# Altium project RFSOC_SAWG.PrjPCB (part 9 of 10)

## Sheet RF_PLL_channel.SchDoc: RFSOC SAWG
size 420 x 297 mm; Author: G.Kasprowicz; CompanyName: WUT; DrawnBy: G.Kasprowicz; Organization: WUT ISE; Address1: Warsaw Univeristy of Technology; Address2: Nowowiejska 15/19; DocumentNumber: 18; Revision: 1; SheetNumber: 18; SheetTotal: 20; EDA_Number: ARTIQ; Projet: ARTIQ/SINARA; ModifiedBy: -; CreateDate: XX/XX/XXXX; CheckedDate: -; Title2: RF PLL; DivGrp: ISE; Designer: G.Kasprowicz; ModifiedDate: -; ProjectName: ARTIQ/SINARA
Used 3 times, as channels U_RF_PLL_channel2, U_RF_PLL_channel0, U_RF_PLL_channel1. Parts and nets are listed once, with the designators drawn on the sheet.
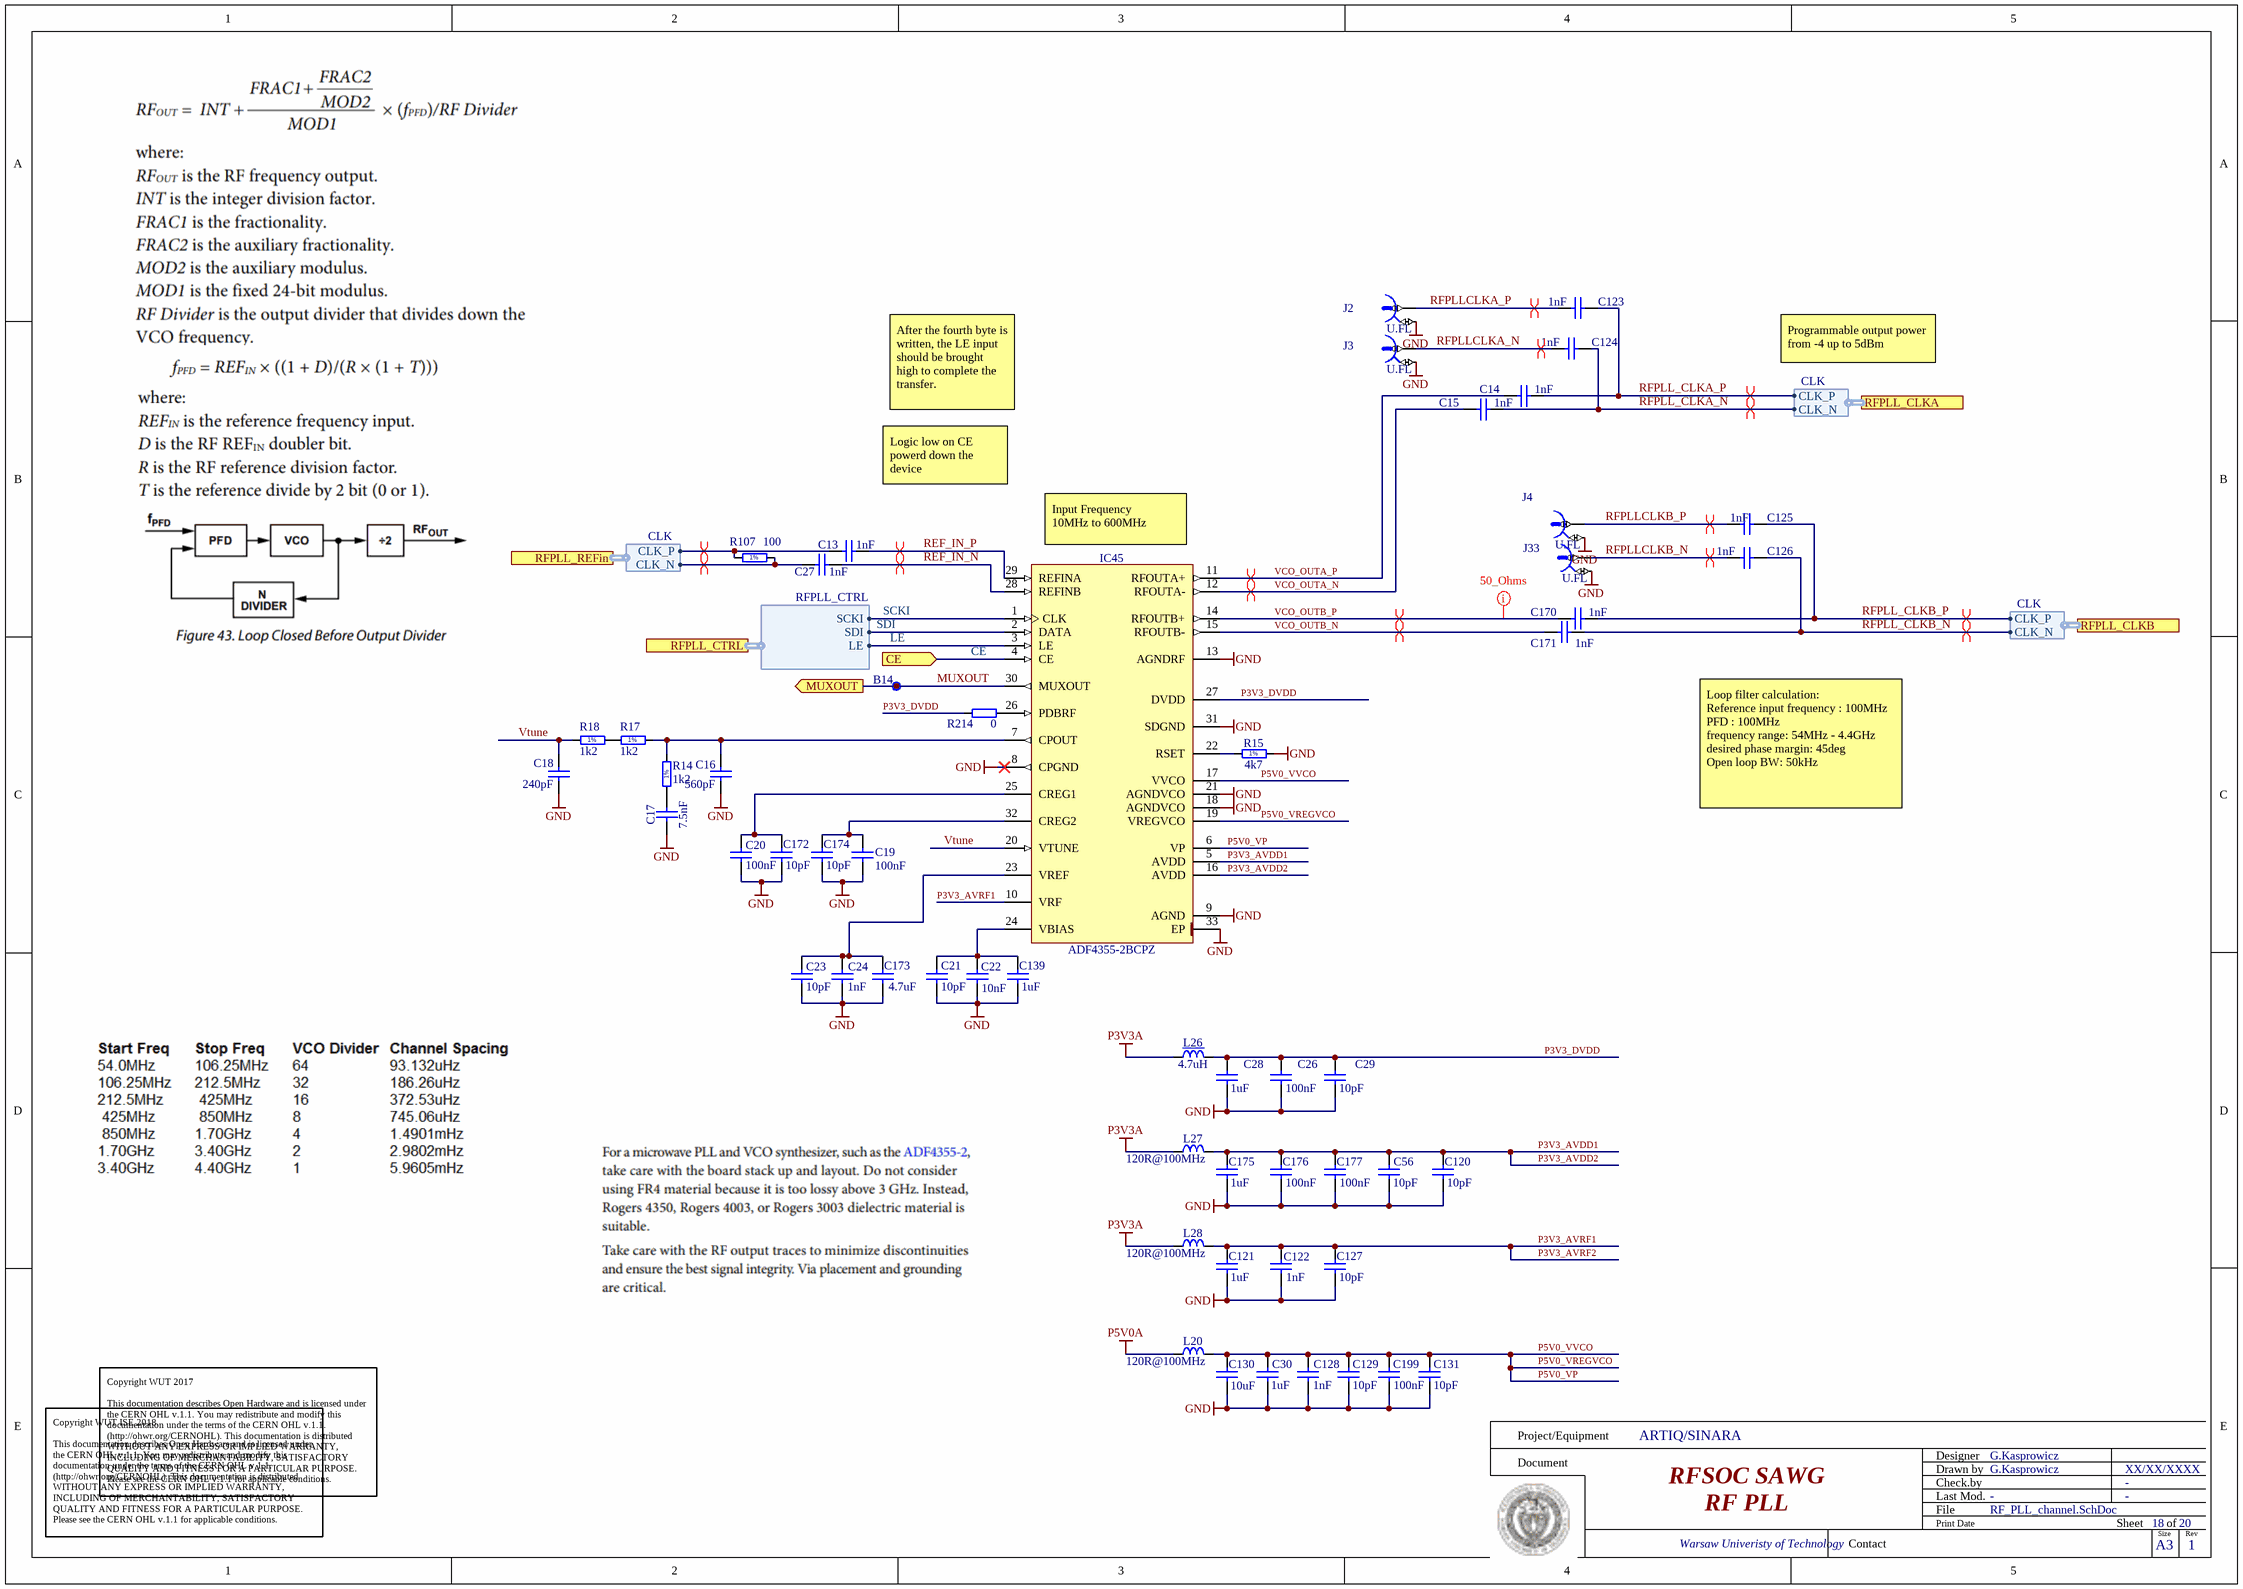
[diagram p16: RF_PLL_channel.SchDoc]

### Parts
B14  SMD Pad  [C100]  (value not drawn)  (no BOM)
C13  1nF  [CAPC1005X55N]
C14  1nF  [CAPC1005X55N]
C15  1nF  [CAPC1005X55N]
C16  560pF  [CAPC1005X55N]
C17  7.5nF  [CAPC1608X87N]
C18  240pF  [CAPC1005X55N]
C19  100nF  [CAPC1005X55N]
C20  100nF  [CAPC1005X55N]
C21  10pF  [CAPC1005X55N]
C22  10nF  [CAPC1005X55N]
C23  10pF  [CAPC1005X55N]
C24  1nF  [CAPC1005X55N]
C26  100nF  [CAPC1005X55N]
C27  1nF  [CAPC1005X55N]
C28  1uF  [CAPC1005X55N]
C29  10pF  [CAPC1005X55N]
C30  1uF  [CAPC1005X55N]
C56  10pF  [CAPC1005X55N]
C120  10pF  [CAPC1005X55N]
C121  1uF  [CAPC1005X55N]
C122  1nF  [CAPC1005X55N]
C123  1nF  [CAPC1005X55N]
C124  1nF  [CAPC1005X55N]
C125  1nF  [CAPC1005X55N]
C126  1nF  [CAPC1005X55N]
C127  10pF  [CAPC1005X55N]
C128  1nF  [CAPC1005X55N]
C129  10pF  [CAPC1005X55N]
C130  10uF  [CAPC1608X80N]
C131  10pF  [CAPC1005X55N]
C139  1uF  [CAPC1005X55N]
C170  1nF  [CAPC1005X55N]
C171  1nF  [CAPC1005X55N]
C172  10pF  [CAPC1005X55N]
C173  4.7uF  [CAPC1608X80N]
C174  10pF  [CAPC1005X55N]
C175  1uF  [CAPC1005X55N]
C176  100nF  [CAPC1005X55N]
C177  100nF  [CAPC1005X55N]
C199  100nF  [CAPC1005X55N]
IC45  ADF4355-2BCPZ  [QFN50P500X500X80-33N-S375]
J2  U.FL  [HIROSE_U.FL-R-SMT-1(10)]
J3  U.FL  [HIROSE_U.FL-R-SMT-1(10)]
J4  U.FL  [HIROSE_U.FL-R-SMT-1(10)]
J33  U.FL  [HIROSE_U.FL-R-SMT-1(10)]
L20  120R@100MHz  [INDC1608X95N]
L26  4.7uH  [INDC2012X145N]
L27  120R@100MHz  [INDC1608X95N]
L28  120R@100MHz  [INDC1608X95N]
R14  1k2  [RESC1005X40N]
R15  4k7  [RESC1005X40N]
R17  1k2  [RESC1005X40N]
R18  1k2  [RESC1005X40N]
R107  100  [RESC1005X40N]
R214  0  [RESC1005X40N]

### Ports
CE (in), MUXOUT (out), RFPLL_CLKA (harness CLK), RFPLL_CLKB (harness CLK), RFPLL_CTRL (harness RFPLL_CTRL), RFPLL_REFin (harness CLK)

### Harnesses
CLK: CLK_P, CLK_N
RFPLL_CTRL: SCKI, SDI, LE

### Nets
GND: C16.1 C17.1 C18.1 C19.1 C20.1 C21.1 C22.1 C23.1 C24.1 C26.1 C28.1 C29.1 C30.1 C56.1 C120.1 C121.1 C122.1 C127.1 C128.1 C129.1 C130.1 C131.1 C139.1 C172.1 C173.1 C174.1 C175.1 C176.1 C177.1 C199.1 IC45.8(CPGND) IC45.9(AGND) IC45.13(AGNDRF) IC45.18(AGNDVCO) IC45.21(AGNDVCO) IC45.31(SDGND) IC45.33(EP) J2.2 J3.2 J4.2 J33.2 R15.2
P3V3A: L26.1 L27.2 L28.2
P5V0A: L20.2
CE: IC45.4(CE) ; port CE
LE: IC45.3(LE) ; port RFPLL_CTRL.LE
MUXOUT: B14.1 IC45.30(MUXOUT) ; port MUXOUT
P3V3_AVDD1: C56.2 C120.2 C175.2 C176.2 C177.2 IC45.5(AVDD) IC45.16(AVDD) L27.1  [also labelled P3V3_AVDD2]
P3V3_AVRF1: C121.2 C122.2 C127.2 IC45.10(VRF) L28.1  [also labelled P3V3_AVRF2]
P3V3_DVDD: C26.2 C28.2 C29.2 IC45.27(DVDD) L26.2 R214.1
P5V0_VP: C30.2 C128.2 C129.2 C130.2 C131.2 C199.2 IC45.6(VP) IC45.17(VVCO) IC45.19(VREGVCO) L20.1  [also labelled P5V0_VREGVCO, P5V0_VVCO]
REF_IN_N: C27.2 IC45.28(REFINB)
REF_IN_P: C13.2 IC45.29(REFINA)
RFPLL_CLKA_N: C15.2 C124.1 ; port RFPLL_CLKA.CLK_N
RFPLL_CLKA_P: C14.2 C123.1 ; port RFPLL_CLKA.CLK_P
RFPLL_CLKB_N: C126.1 C171.2 ; port RFPLL_CLKB.CLK_N
RFPLL_CLKB_P: C125.1 C170.2 ; port RFPLL_CLKB.CLK_P
RFPLLCLKA_N: C124.2 J3.1
RFPLLCLKA_P: C123.2 J2.1
RFPLLCLKB_N: C126.2 J33.1
RFPLLCLKB_P: C125.2 J4.1
SCKI: IC45.1(CLK) ; port RFPLL_CTRL.SCKI
SDI: IC45.2(DATA) ; port RFPLL_CTRL.SDI
VCO_OUTA_N: C15.1 IC45.12(RFOUTA-)
VCO_OUTA_P: C14.1 IC45.11(RFOUTA+)
VCO_OUTB_N: C171.1 IC45.15(RFOUTB-)
VCO_OUTB_P: C170.1 IC45.14(RFOUTB+)
Vtune: C18.2 IC45.20(VTUNE) R18.2
NetC13_1: C13.1 R107.1 ; port RFPLL_REFin.CLK_P
NetC16_2: C16.2 IC45.7(CPOUT) R14.2 R17.1
NetC17_2: C17.2 R14.1
NetC19_2: C19.2 C174.2 IC45.32(CREG2)
NetC20_2: C20.2 C172.2 IC45.25(CREG1)
NetC21_2: C21.2 C22.2 C139.2 IC45.24(VBIAS)
NetC23_2: C23.2 C24.2 C173.2 IC45.23(VREF)
NetC27_1: C27.1 R107.2 ; port RFPLL_REFin.CLK_N
NetIC45_22: IC45.22(RSET) R15.1
NetIC45_26: IC45.26(PDBRF) R214.2
NetR17_2: R17.2 R18.1

### Channels
U_RF_PLL_channel2: designators end in A; ports CE=CE MUXOUT=MUXOUT
U_RF_PLL_channel0: designators end in B; ports CE=CE MUXOUT=MUXOUT
U_RF_PLL_channel1: designators end in C; ports CE=CE MUXOUT=MUXOUT

### Layout directives
differential pair: DAC_CLK_228_N, DAC_CLK_228_P, DAC_CLK_229_N, DAC_CLK_229_P, REF_IN_N_U_RF_PLL_channel2, REF_IN_P_U_RF_PLL_channel2, RFPLL_REFin0_N, RFPLL_REFin0_P, RFPLLCLKA_N_U_RF_PLL_channel2, RFPLLCLKA_P_U_RF_PLL_channel2, RFPLLCLKB_N_U_RF_PLL_channel2, RFPLLCLKB_P_U_RF_PLL_channel2, VCO_OUTA_N_U_RF_PLL_channel2, VCO_OUTA_P_U_RF_PLL_channel2, VCO_OUTB_N_U_RF_PLL_channel2, VCO_OUTB_P_U_RF_PLL_channel2
net class 50_Ohms: VCO_OUTB_P_U_RF_PLL_channel2

### Notes on the sheet
- Programmable output power from -4 up to 5dBm
- After the fourth byte is written, the LE input should be brought high to complete the transfer.
- Logic low on CE powerd down the device
- (near IC45) Input Frequency
  10MHz to 600MHz
- Loop filter calculation:
  Reference input frequency : 100MHz
  PFD : 100MHz
  frequency range: 54MHz - 4.4GHz
  desired phase margin: 45deg
  Open loop BW: 50kHz
- Copyright WUT 2017
  This documentation describes Open Hardware and is licensed under the CERN OHL v.1.1. You may redistribute and modify this documentation under the terms of the CERN OHL v.1.1. (http://ohwr.org/CERNOHL). This documentation is distributed WITHOUT ANY EXPRESS OR IMPLIED WARRANTY, INCLUDING OF MERCHANTABILITY, SATISFACTORY QUALITY AND FITNESS FOR A PARTICULAR PURPOSE. Please see the CERN OHL v.1.1 for applicable conditions.
- Project/Equipment
- Document
- Designer
- Drawn by
- Check.by
- Copyright WUT ISE 2018.
  This documentation describes Open Hardware and is licensed under the CERN OHL v.1.1. You may redistribute and modify this documentation under the terms of the CERN OHL v.1.1. (http://ohwr.org/CERNOHL). This documentation is distributed WITHOUT ANY EXPRESS OR IMPLIED WARRANTY, INCLUDING OF MERCHANTABILITY, SATISFACTORY QUALITY AND FITNESS FOR A PARTICULAR PURPOSE. Please see the CERN OHL v.1.1 for applicable conditions.
- Contact
- File
- Last Mod.
- Print Date
- Sheet
- Size
- A3
- of
- Rev
- (in symbol R0402_4K7_1%_0.0625W_100PPM) 1%
- (in symbol R0402_49R9_1%_0.0625W_100PPM) 1%
- (in symbol R0402_100R_1%_0.0625W_100PPM) 1%

### Library data of the parts
B14 = SMD_PAD_D1MM: Through Hole Pad; Part Description: 1mm Diameter SMD Pad; Mounted: No; Part Number: SMD_PAD_D1MM; Component Type: Standard (No BOM); Pin Count: 1; Family: SMD Pad; Socket: No; SMD: No; Sense: No; Status: None; ComponentHeight: 0mm; HelpURL: Undefined; Author: CERN DEM JLC; CreateDate: 10.10.2017; LatestRevisionDate: 10.10.2017; PackageDescription: 1mm Diameter SMD Pad
C13-C15 C24 C27 C122-C126 C128 C170 C171 = CC0402_1NF_50V_10%_X7R: as C228 on sheet AWG_ClockRecovery; Part Number: CC0402_1NF_50V_10%_X7R; Component Kind: Standard; Component Type: Standard; Pin Count: 2; Value: 1nF; Status: Not Recommended; Manufacturer Part Number: CC0402_1NF_50V_10%_X7R; Case: 0402; Mounted: Yes; Socket: No; SMD: Yes; Sense: No; Manufacturer1 Example: PHYCOMP; Manufacturer1 ComponentHeight: 0.55mm; HelpURL: \\cern.ch\dfs\Applications\Altium\Datasheets\CC0402_X7R_PHYCOMP.pdf; Author: CERN DEM JLC; CreateDate: 03.12.2007; LatestRevisionDate: 03.12.2007
C16 = CC0402_10PF_50V_5%_C0G: Non-polarised capacitor; Part Number: CC0402_560PF_50V_5%_C0G; Part Description: SMD Multilayer Chip Ceramic Capacitor; Manufacturer: GENERIC; Manufacturer1 Part Number: GCM1555C1H561JA16D; Voltage: 50V; TC: C0G/NP0; Tolerance: ±5%; Component Kind: Standard; Component Type: Standard; Pin Count: 2; Value: 560pF; Status: Preferred; Manufacturer Part Number: CC0402_560PF_50V_5%_C0G; Case: 0402; Mounted: Yes; Socket: No; SMD: Yes; Sense: No; Manufacturer1 Example: Murata; Manufacturer1 ComponentHeight: 0.55mm; HelpURL: \\cern.ch\dfs\Applications\Altium\Datasheets\CC0805_C0G_KEMET_(Commercial Grade).pdf; Author: CERN DEM JLC; CreateDate: 2007-12-03; LatestRevisionDate: 2015-04-22
C17 = CC0603_7.5NF_25V_5%_C0G: Non-polarised capacitor; Part Description: SMD Multilayer Chip Ceramic Capacitor; Manufacturer: GENERIC; Manufacturer1 Part Number: C0603C752J3GACTU; Voltage: 25V; TC: C0G/NP0; Tolerance: ±5%; Part Number: CC0603_7.5NF_25V_5%_C0G; Component Kind: Standard; Component Type: Standard; Pin Count: 2; Value: 7.5nF; Status: Preferred; Manufacturer Part Number: CC0603_7.5NF_25V_5%_C0G; Case: 0603; Mounted: Yes; Socket: No; SMD: Yes; Sense: No; Manufacturer1 Example: KEMET; Manufacturer1 ComponentHeight: 0.87mm; HelpURL: \\cern.ch\dfs\Applications\Altium\Datasheets\CC0603_C0G_KEMET.pdf; Author: CERN DEM JLC; CreateDate: 01.10.2013; LatestRevisionDate: 01.10.2013
C18 = CC0402_10PF_50V_5%_C0G: Non-polarised capacitor; Part Number: CC0402_240PF_50V_5%_C0G; Part Description: SMD Multilayer Chip Ceramic Capacitor; Manufacturer: GENERIC; Manufacturer1 Part Number: GRM1555C1H241JA01D; Voltage: 50V; TC: C0G/NP0; Tolerance: ±5%; Component Kind: Standard; Component Type: Standard; Pin Count: 2; Value: 240pF; Status: Preferred; Manufacturer Part Number: CC0402_240PF_50V_5%_C0G; Case: 0402; Mounted: Yes; Socket: No; SMD: Yes; Sense: No; Manufacturer1 Example: MURATA; Manufacturer1 ComponentHeight: 0.55mm; HelpURL: \\cern.ch\dfs\Applications\Altium\Datasheets\CC0805_C0G_KEMET_(Commercial Grade).pdf; Author: CERN DEM JLC; CreateDate: 2007-12-03; LatestRevisionDate: 2015-04-22
C19 C20 C26 C176 C177 C199 = CC0402_100NF_16V_10%_X5R: as C138 on sheet AWG_ClockRecovery; Part Number: CC0402_100NF_16V_10%_X5R; Component Kind: Standard; Component Type: Standard; Pin Count: 2; Value: 100nF; Status: None; Manufacturer Part Number: CC0402_100NF_16V_10%_X5R; Case: 0402; Mounted: Yes; Socket: No; SMD: Yes; Sense: No; Manufacturer1 Example: MURATA; Manufacturer1 ComponentHeight: 0.55mm; HelpURL: \\cern.ch\dfs\Applications\Altium\Datasheets\CC0402_X5R_MURATA_GRM.pdf; Author: CERN DEM JLC; CreateDate: 10.12.2013; LatestRevisionDate: 10.12.2013
C21 C23 C29 C56 C120 C127 C129 C131 C172 C174 = CC0402_10PF_50V_5%_C0G: Non-polarised capacitor; Part Description: SMD Multilayer Chip Ceramic Capacitor; Manufacturer: GENERIC; Manufacturer1 Part Number: C0402C100J5GACTU; Voltage: 50V; TC: C0G/NP0; Tolerance: ±5%; Part Number: CC0402_10PF_50V_5%_C0G; Component Kind: Standard; Component Type: Standard; Pin Count: 2; Value: 10pF; Status: Preferred; Manufacturer Part Number: CC0402_10PF_50V_5%_C0G; Case: 0402; Mounted: Yes; Socket: No; SMD: Yes; Sense: No; Manufacturer1 Example: KEMET; Manufacturer1 ComponentHeight: 0.55mm; HelpURL: \\cern.ch\dfs\Applications\Altium\Datasheets\CC0805_C0G_KEMET_(Commercial Grade).pdf; Author: CERN DEM JLC; CreateDate: 2007-12-03; LatestRevisionDate: 2015-04-22
C22 = CC0402_10NF_16V_10%_X7R: Non-polarised capacitor; Part Description: SMD Multilayer Chip Ceramic Capacitor; Manufacturer: GENERIC; Manufacturer1 Part Number: 223878715636; Voltage: 16V; TC: X7R; Tolerance: ±10%; Part Number: CC0402_10NF_16V_10%_X7R; Component Kind: Standard; Component Type: Standard; Pin Count: 2; Value: 10nF; Status: Not Recommended; Manufacturer Part Number: CC0402_10NF_16V_10%_X7R; Case: 0402; Mounted: Yes; Socket: No; SMD: Yes; Sense: No; Manufacturer1 Example: PHYCOMP; Manufacturer1 ComponentHeight: 0.55mm; HelpURL: \\cern.ch\dfs\Applications\Altium\Datasheets\CC0402_X7R_PHYCOMP.pdf; Author: CERN DEM JLC; CreateDate: 03.12.2007; LatestRevisionDate: 03.12.2007
C28 C30 C121 C139 C175 = CC0402_1UF_16V_10%_X5R: as C178 on sheet AWG_SFPs; Part Number: CC0402_1UF_16V_10%_X5R; Component Kind: Standard; Component Type: Standard; Pin Count: 2; Value: 1uF; Status: Preferred; Manufacturer Part Number: CC0402_1UF_16V_10%_X5R; Case: 0402; Mounted: Yes; Socket: No; SMD: Yes; Sense: No; Manufacturer1 Example: TDK; Manufacturer1 ComponentHeight: 0.55mm; HelpURL: \\cern.ch\dfs\Applications\Altium\Datasheets\CC0402_X5R_TDK_C.pdf; Author: CERN DEM JLC; CreateDate: 2012-10-25; LatestRevisionDate: 2012-10-25
C130 = CC0603_10UF_16V_20%_X5R: as C201 on sheet AWG_ClockRecovery; Part Number: CC0603_10UF_16V_20%_X5R; Component Kind: Standard; Component Type: Standard; Pin Count: 2; Value: 10uF; Status: None; Manufacturer Part Number: CC0603_10UF_16V_20%_X5R; Case: 0603; Mounted: Yes; Socket: No; SMD: Yes; Sense: No; Manufacturer1 Example: MURATA; Manufacturer1 ComponentHeight: 0.8mm; HelpURL: \\cern.ch\dfs\Applications\Altium\Datasheets\CC0603_X5R_MURATA_GRM.pdf; Author: CERN DEM MR; CreateDate: 2016-03-02; LatestRevisionDate: 2016-03-02
C173 = CC0603_10UF_16V_20%_X5R: Non-polarised capacitor; Part Number: CC0603_4U7F_16V_10%_X5R; Part Description: SMD Multilayer Chip Ceramic Capacitor; Manufacturer: GENERIC; Manufacturer1 Part Number: C1608X5R1C475K080AC; Voltage: 16V; TC: X5R; Tolerance: ±10%; Component Kind: Standard; Component Type: Standard; Pin Count: 2; Value: 4.7uF; Status: None; Manufacturer Part Number: CC0603_4U7F_16V_10%_X5R; Case: 0603; Mounted: Yes; Socket: No; SMD: Yes; Sense: No; Manufacturer1 Example: TDK; Manufacturer1 ComponentHeight: 0.8mm; HelpURL: \\cern.ch\dfs\Applications\Altium\Datasheets\CC0603_X5R_MURATA_GRM.pdf; Author: CERN DEM MR; CreateDate: 2016-03-02; LatestRevisionDate: 2016-03-02
IC45 = ADF4355-2BCPZ: Microwave Wideband Synthesizer with Integrated VCO; Manufacturer: ANALOG DEVICES; PressFit: No; Bonding: No; Part Number: ADF4355-2BCPZ; Component Kind: Standard; Component Type: Standard; Device: ADF4355-2BCPZ; PackageDescription: QFN, (MO-220-WHHD-5) 0.50mm Pitch, Square; 32 Pin, 5.00mm L X 5.00mm W X 0.80mm H body (w/Thermal Tab 3.75 X 3.75mm), IPC Medium Density; Part Description: Microwave Wideband Synthesizer with Integrated VCO; Manufacturer Part Number: ADF4355-2BCP; Pin Count: 33; Case: QFN32; Mounted: Yes; Socket: No; SMD: Yes; Sense: No; ComponentHeight: 0.8mm; Author: CERN DEM BC; HelpURL: \\cern.ch\dfs\Applications\Altium\Datasheets\ADF4355-2BCPZ.pdf; CreateDate: 21.07.2021; LatestRevisionDate: 22.03.2022
J2-J4 J33 = HIROSE_U.FL-R-SMT-1(10): Part Description: Up to 6GHz Ultra Small Surface Mount Male Coaxial Connectors U.FL Series; Manufacturer: HIROSE (HRS); PressFit: No; Part Number: HIROSE_U.FL-R-SMT-1(10); Component Kind: Standard; Component Type: Standard; Pin Count: 2; Family: U.FL; Mounted: Yes; Socket: No; SMD: Yes; Sense: No; Status: None; Manufacturer Part Number: U.FL-R-SMT-1(10); ComponentHeight: 1.25mm; HelpURL: \\cern.ch\dfs\Applications\Altium\Datasheets\HIROSE_U.FL-R-SMT-1(10).pdf; Author: CERN DEM JLC; CreateDate: 24.03.2010; LatestRevisionDate: 24.03.2010
L20 L27 L28 = IND0603_MURATA_BLM18PG121SN1D: Inductor; Part Description: SMD EMIFIL Chip Ferrite Bead; Manufacturer: MURATA; Power: 2A; Resistance: 0.05R; Part Number: IND0603_MURATA_BLM18PG121SN1D; Component Kind: Standard; Component Type: Standard; Pin Count: 2; Value: 120R@100MHz; Status: None; Manufacturer Part Number: BLM18PG121SN1D; Case: 0603; Mounted: Yes; Socket: No; SMD: Yes; Sense: No; ComponentHeight: 0.95mm; HelpURL: \\cern.ch\dfs\Applications\Altium\Datasheets\IND0603_MURATA_BLM18P.pdf; Author: CERN DEM BC; CreateDate: 2015-07-27; LatestRevisionDate: 2015-07-27
L26 = IND0805_4.7UH_20%_KEMET_L-DWI: Inductor With Core; Part Description: Wire Wound Chip Inductors; Manufacturer: KEMET; Manufacturer Part Number: L0805C4R7MDWIT; Power: 360mA; Resistance: 0.5R; Tolerance: ±20%; Part Number: IND0805_4.7UH_20%_KEMET_L-DWI; Component Kind: Standard; Component Type: Standard; Pin Count: 2; Value: 4.7uH; Status: None; Case: 0805; Mounted: Yes; Socket: No; SMD: Yes; Sense: No; ComponentHeight: 1.45mm; HelpURL: \\cern.ch\dfs\Applications\Altium\Datasheets\IND0805_KEMET_L-DWI .pdf; Author: CERN DEM JLC; CreateDate: 26.01.2010; LatestRevisionDate: 26.01.2010
R14 R17 R18 = R0402_49R9_1%_0.0625W_100PPM: Resistor - 1%; Part Number: R0402_1K2_1%_0.0625W_100PPM; Part Description: General Purpose Thick Film Chip Resistor; Manufacturer: GENERIC; Manufacturer1 Part Number: NRC04F1201TRF; TC: ±100ppm/°C; PressFit: No; Component Kind: Standard; Component Type: Standard; Pin Count: 2; Value: 1k2; Status: Preferred; Power: 0.0625W; Tolerance: ±1%; Manufacturer Part Number: R0402_1K2_1%_0.0625W_100PPM; Case: 0402; Mounted: Yes; Sense: No; Socket: No; SMD: Yes; Manufacturer1 Example: NIC COMPONENT; Manufacturer1 ComponentHeight: 0.4mm; HelpURL: \\cern.ch\dfs\Applications\Altium\Datasheets\R0402_Phycomp_RC0402.pdf; Author: CERN DEM JLC; CreateDate: 24.10.2012; LatestRevisionDate: 24.10.2012
R15 = R0402_4K7_1%_0.0625W_100PPM: Resistor - 1%; Part Description: General Purpose Thick Film Chip Resistor; Manufacturer: GENERIC; Manufacturer1 Part Number: 232270674702L; TC: ±100ppm/°C; Part Number: R0402_4K7_1%_0.0625W_100PPM; Component Kind: Standard; Component Type: Standard; Pin Count: 2; Value: 4k7; Status: Not recommended; Power: 0.0625W; Tolerance: ±1%; Manufacturer Part Number: R0402_4K7_1%_0.0625W_100PPM; Case: 0402; Mounted: Yes; Sense: No; Socket: No; SMD: Yes; Manufacturer1 Example: YAGEO PHYCOMP; Manufacturer1 ComponentHeight: 0.4mm; HelpURL: \\cern.ch\dfs\Applications\Altium\Datasheets\R0402_Phycomp_RC0402.pdf; Author: CERN DEM JLC; CreateDate: 2007-12-03; LatestRevisionDate: 2012-10-17
R107 = R0402_100R_1%_0.0625W_100PPM: as R69 on sheet AWG_ClockRecovery; Part Number: R0402_100R_1%_0.0625W_100PPM; Component Kind: Standard; Component Type: Standard; Pin Count: 2; Value: 100; Status: Not Recommended; Power: 0.0625W; Tolerance: ±1%; Manufacturer Part Number: R0402_100R_1%_0.0625W_100PPM; Case: 0402; Mounted: Yes; Sense: No; Socket: No; SMD: Yes; Manufacturer1 Example: YAGEO PHYCOMP; Manufacturer1 ComponentHeight: 0.4mm; HelpURL: \\cern.ch\dfs\Applications\Altium\Datasheets\R0402_Phycomp_RC0402.pdf; Author: CERN DEM JLC; CreateDate: 03.12.2007; LatestRevisionDate: 17.10.2012
R214 = R0402_0R_JUMPER: as R92 on sheet ADC_Input_CH; Part Number: R0402_0R_JUMPER; Component Kind: Standard; Component Type: Standard; Pin Count: 2; Value: 0; Status: Not Recommended; Manufacturer Part Number: R0402_0R_JUMPER; Case: 0402; Mounted: Yes; Sense: No; Socket: No; SMD: Yes; Manufacturer1 Example: YAGEO PHYCOMP; Manufacturer1 ComponentHeight: 0.4mm; HelpURL: \\cern.ch\dfs\Applications\Altium\Datasheets\R0402_Phycomp_RC0402.pdf; Author: CERN DEM JLC; CreateDate: 03.12.2007; LatestRevisionDate: 17.10.2012

## Sheet SPI_Extender.SchDoc: RFSOC SAWG
size 420 x 297 mm; Author: G.Kasprowicz; CompanyName: WUT ISE; DrawnBy: G.Kasprowicz; Organization: WUT ISE; Address1: PW ISE; Address2: Nowowiejska 15/19 00-665 Warsaw; Address3: gkasprow@gmail.com; DocumentNumber: 20; Revision: 1; SheetNumber: 20; SheetTotal: 20; ModifiedBy: -; CheckedDate: -; Title2: SPI Extender; DivGrp: WUT ISE; Designer: G.Kasprowicz; ModifiedDate: -; ProjectName: Sensor Box
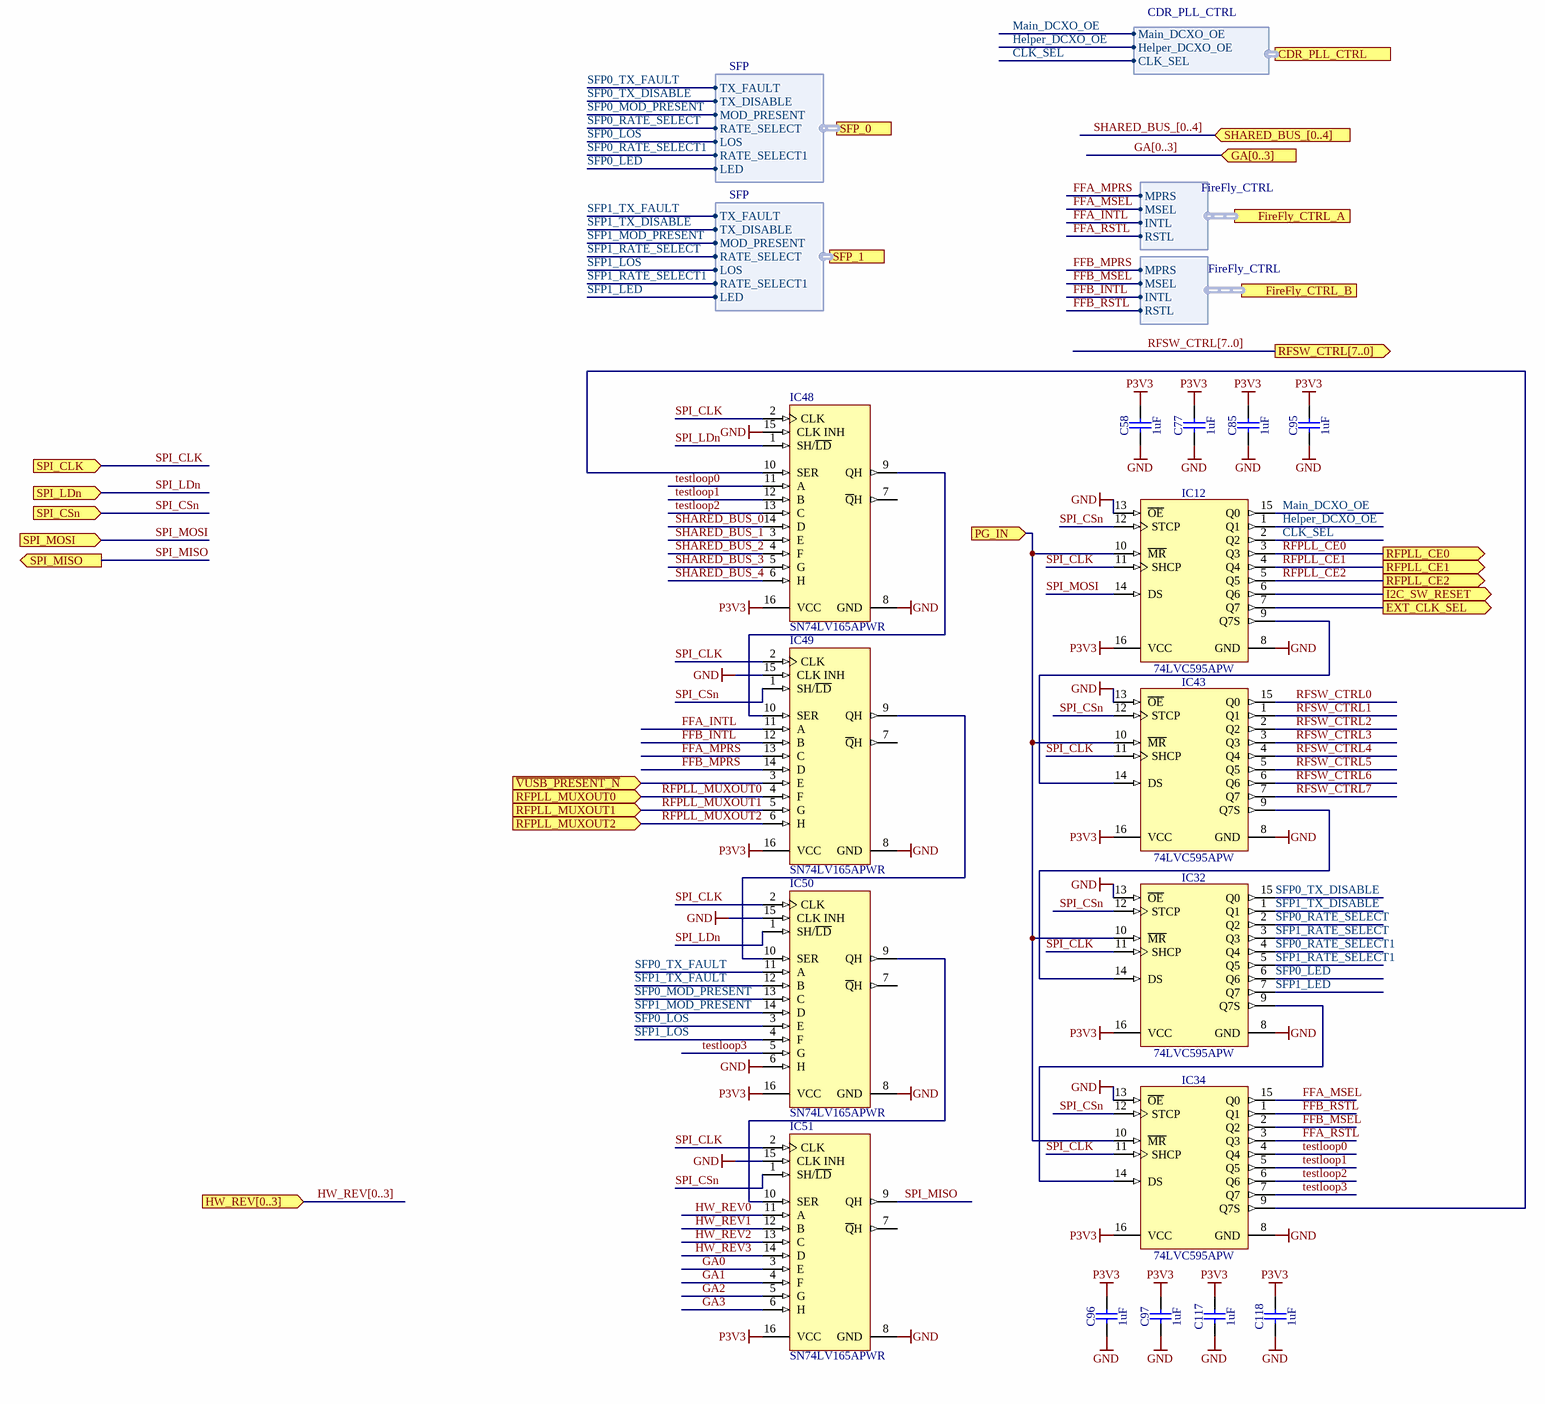
[diagram p17: SPI_Extender.SchDoc]

### Parts
C58  1uF  [CAPC1608X87N]
C77  1uF  [CAPC1608X87N]
C85  1uF  [CAPC1608X87N]
C95  1uF  [CAPC1608X87N]
C96  1uF  [CAPC1608X87N]
C97  1uF  [CAPC1608X87N]
C117  1uF  [CAPC1608X87N]
C118  1uF  [CAPC1608X87N]
IC12  74LVC595APW  [SOP65P640X110-16N]
IC32  74LVC595APW  [SOP65P640X110-16N]
IC34  74LVC595APW  [SOP65P640X110-16N]
IC43  74LVC595APW  [SOP65P640X110-16N]
IC48  SN74LV165APWR  [PW0016A_M]
IC49  SN74LV165APWR  [PW0016A_M]
IC50  SN74LV165APWR  [PW0016A_M]
IC51  SN74LV165APWR  [PW0016A_M]

### Ports
CDR_PLL_CTRL (harness CDR_PLL_CTRL), EXT_CLK_SEL (out), FireFly_CTRL_A (harness FireFly_CTRL), FireFly_CTRL_B (harness FireFly_CTRL), GA[0..3] (in), HW_REV[0..3] (in), I2C_SW_RESET (out), PG_IN (in), RFPLL_CE0 (out), RFPLL_CE1 (out), RFPLL_CE2 (out), RFPLL_MUXOUT0 (in), RFPLL_MUXOUT1 (in), RFPLL_MUXOUT2 (in), RFSW_CTRL[7..0] (out), SFP_0 (harness SFP), SFP_1 (harness SFP), SHARED_BUS_[0..4] (in), SPI_CLK (in), SPI_CSn (in), SPI_LDn (in), SPI_MISO (out), SPI_MOSI (in), ~{VUSB_PRESENT_N} (in)

### Harnesses
FireFly_CTRL: MPRS, MSEL, INTL, RSTL
CDR_PLL_CTRL: Main_DCXO_OE, Helper_DCXO_OE, CLK_SEL
SFP: TX_FAULT, LOS, MOD_PRESENT, TX_DISABLE, RATE_SELECT, LED, RATE_SELECT1

### Nets
GND: C58.1 C77.1 C85.1 C95.1 C96.1 C97.1 C117.1 C118.1 IC12.8(GND) IC12.13(~{OE}) IC32.8(GND) IC32.13(~{OE}) IC34.8(GND) IC34.13(~{OE}) IC43.8(GND) IC43.13(~{OE}) IC48.8(GND) IC48.15(CLK_INH) IC49.8(GND) IC49.15(CLK_INH) IC50.6(H) IC50.8(GND) IC50.15(CLK_INH) IC51.8(GND) IC51.15(CLK_INH)
P3V3: C58.2 C77.2 C85.2 C95.2 C96.2 C97.2 C117.2 C118.2 IC12.16(VCC) IC32.16(VCC) IC34.16(VCC) IC43.16(VCC) IC48.16(VCC) IC49.16(VCC) IC50.16(VCC) IC51.16(VCC)
~{VUSB_PRESENT_N}: IC49.3(E) ; port ~{VUSB_PRESENT_N}
CLK_SEL: IC12.2(Q2) ; port CDR_PLL_CTRL.CLK_SEL
EXT_CLK_SEL: IC12.7(Q7) ; port EXT_CLK_SEL
FFA_INTL: IC49.11(A) ; port FireFly_CTRL_A.INTL
FFA_MPRS: IC49.13(C) ; port FireFly_CTRL_A.MPRS
FFA_MSEL: IC34.15(Q0) ; port FireFly_CTRL_A.MSEL
FFA_RSTL: IC34.3(Q3) ; port FireFly_CTRL_A.RSTL
FFB_INTL: IC49.12(B) ; port FireFly_CTRL_B.INTL
FFB_MPRS: IC49.14(D) ; port FireFly_CTRL_B.MPRS
FFB_MSEL: IC34.2(Q2) ; port FireFly_CTRL_B.MSEL
FFB_RSTL: IC34.1(Q1) ; port FireFly_CTRL_B.RSTL
GA0: IC51.3(E)
GA1: IC51.4(F)
GA2: IC51.5(G)
GA3: IC51.6(H)
Helper_DCXO_OE: IC12.1(Q1) ; port CDR_PLL_CTRL.Helper_DCXO_OE
HW_REV0: IC51.11(A)
HW_REV1: IC51.12(B)
HW_REV2: IC51.13(C)
HW_REV3: IC51.14(D)
I2C_SW_RESET: IC12.6(Q6) ; port I2C_SW_RESET
Main_DCXO_OE: IC12.15(Q0) ; port CDR_PLL_CTRL.Main_DCXO_OE
PG_1.8V: IC12.10(~{MR}) IC32.10(~{MR}) IC34.10(~{MR}) IC43.10(~{MR}) ; port PG_IN
RFPLL_CE0: IC12.3(Q3) ; port RFPLL_CE0  [project net CE]
RFPLL_CE1: IC12.4(Q4) ; port RFPLL_CE1  [project net CE]
RFPLL_CE2: IC12.5(Q5) ; port RFPLL_CE2  [project net CE]
RFPLL_MUXOUT0: IC49.4(F) ; port RFPLL_MUXOUT0  [project net MUXOUT]
RFPLL_MUXOUT1: IC49.5(G) ; port RFPLL_MUXOUT1  [project net MUXOUT]
RFPLL_MUXOUT2: IC49.6(H) ; port RFPLL_MUXOUT2  [project net MUXOUT]
RFSW_CTRL0: IC43.15(Q0)
RFSW_CTRL1: IC43.1(Q1)
RFSW_CTRL2: IC43.2(Q2)
RFSW_CTRL3: IC43.3(Q3)
RFSW_CTRL4: IC43.4(Q4)
RFSW_CTRL5: IC43.5(Q5)
RFSW_CTRL6: IC43.6(Q6)
RFSW_CTRL7: IC43.7(Q7)
SFP0_LED: IC32.6(Q6) ; port SFP_0.LED
SFP0_LOS: IC50.3(E) ; port SFP_0.LOS
SFP0_MOD_PRESENT: IC50.13(C) ; port SFP_0.MOD_PRESENT
SFP0_RATE_SELECT: IC32.2(Q2) ; port SFP_0.RATE_SELECT
SFP0_RATE_SELECT1: IC32.4(Q4) ; port SFP_0.RATE_SELECT1
SFP0_TX_DISABLE: IC32.15(Q0) ; port SFP_0.TX_DISABLE
SFP0_TX_FAULT: IC50.11(A) ; port SFP_0.TX_FAULT
SFP1_LED: IC32.7(Q7) ; port SFP_1.LED
SFP1_LOS: IC50.4(F) ; port SFP_1.LOS
SFP1_MOD_PRESENT: IC50.14(D) ; port SFP_1.MOD_PRESENT
SFP1_RATE_SELECT: IC32.3(Q3) ; port SFP_1.RATE_SELECT
SFP1_RATE_SELECT1: IC32.5(Q5) ; port SFP_1.RATE_SELECT1
SFP1_TX_DISABLE: IC32.1(Q1) ; port SFP_1.TX_DISABLE
SFP1_TX_FAULT: IC50.12(B) ; port SFP_1.TX_FAULT
SHARED_BUS_0: IC48.14(D)
SHARED_BUS_1: IC48.3(E)
SHARED_BUS_2: IC48.4(F)
SHARED_BUS_3: IC48.5(G)
SHARED_BUS_4: IC48.6(H)
SPI_CLK: IC12.11(SHCP) IC32.11(SHCP) IC34.11(SHCP) IC43.11(SHCP) IC48.2(CLK) IC49.2(CLK) IC50.2(CLK) IC51.2(CLK) ; port SPI_CLK
SPI_CSn: IC12.12(STCP) IC32.12(STCP) IC34.12(STCP) IC43.12(STCP) IC49.1(SH/~{LD}) IC51.1(SH/~{LD}) ; port SPI_CSn
SPI_LDn: IC48.1(SH/~{LD}) IC50.1(SH/~{LD}) ; port SPI_LDn
SPI_MISO: IC51.9(QH) ; port SPI_MISO
SPI_MOSI: IC12.14(DS) ; port SPI_MOSI
testloop0: IC34.4(Q4) IC48.11(A)
testloop1: IC34.5(Q5) IC48.12(B)
testloop2: IC34.6(Q6) IC48.13(C)
testloop3: IC34.7(Q7) IC50.5(G)
NetIC12_9: IC12.9(Q7S) IC43.14(DS)
NetIC32_9: IC32.9(Q7S) IC34.14(DS)
NetIC32_14: IC32.14(DS) IC43.9(Q7S)
NetIC34_9: IC34.9(Q7S) IC48.10(SER)
NetIC48_9: IC48.9(QH) IC49.10(SER)
NetIC49_9: IC49.9(QH) IC50.10(SER)
NetIC50_9: IC50.9(QH) IC51.10(SER)

Not connected (* = marked no-connect by the designer): IC48 7(~{Q}H); IC49 7(~{Q}H); IC50 7(~{Q}H); IC51 7(~{Q}H)

### Buses and harness runs
bus GA[0..3] = port GA[0..3]
bus HW_REV[0..3] = port HW_REV[0..3]
bus RFSW_CTRL[7..0] = port RFSW_CTRL[7..0]
bus SHARED_BUS_[0..4] = port SHARED_BUS_[0..4]

### Notes on the sheet
- Project/Equipment
- Document
- Designer
- Drawn by
- Check.by
- Copyright WUT ISE 2020.
  This documentation describes Open Hardware and is licensed under the CERN OHL v.1.2. You may redistribute and modify this documentation under the terms of the CERN OHL v.1.2. (http://ohwr.org/CERNOHL). This documentation is distributed WITHOUT ANY EXPRESS OR IMPLIED WARRANTY, INCLUDING OF MERCHANTABILITY, SATISFACTORY QUALITY AND FITNESS FOR A PARTICULAR PURPOSE. Please see the CERN OHL v.1.2 for applicable conditions.
- Contact
- File
- Last Mod.
- Print Date
- Sheet
- Size
- A3
- of
- Rev

### Library data of the parts
C58 C77 C85 C95-C97 C117 C118 = CC0603_1UF_25V_10%_X7R: Non-polarised capacitor; Part Description: SMD Multilayer Chip Ceramic Capacitor; Manufacturer: GENERIC; Manufacturer1 Part Number: GRM188R71E105KA12D; Voltage: 25V; TC: X7R; Tolerance: ±10%; Part Number: CC0603_1UF_25V_10%_X7R; Component Kind: Standard; Component Type: Standard; Pin Count: 2; Value: 1uF; Status: None; Manufacturer Part Number: CC0603_1UF_25V_10%_X7R; Case: 0603; Mounted: Yes; Socket: No; SMD: Yes; Sense: No; Manufacturer1 Example: MURATA; Manufacturer1 ComponentHeight: 0.9mm; HelpURL: \\cern.ch\dfs\Applications\Altium\Datasheets\CC0603_X7R_MURATA.pdf; Author: CERN DEM JLC; CreateDate: 18.01.2011; LatestRevisionDate: 18.01.2011
IC12 IC32 IC34 IC43 = 74LVC595APW: 8-Bit Shift Register With 3-State Output Register; Part Description: 8-Bit Shift Register with 3-State Output Registers; Manufacturer: NEXPERIA; PressFit: No; Bonding: No; Part Number: 74LVC595APW; Component Kind: Standard; Component Type: Standard; Device: 74LVC595APW; PackageDescription: SOP, 0.65mm Pitch; 16 Pin, 4.40mm W X 5.00mm L X 1.10mm H body, IPC Medium Density; Manufacturer Part Number: 74LVC595APW; Pin Count: 16; Case: TSSOP16; Mounted: Yes; Socket: No; SMD: Yes; Sense: No; ComponentHeight: 1.1mm; Author: CERN DEM HF; HelpURL: \\cern.ch\dfs\Applications\Altium\Datasheets\74LVC595APW.pdf; CreateDate: 11.04.2022; LatestRevisionDate: 11.04.2022
IC48-IC51 = CMP-0780-00191-3: Parallel-Load 8-Bit Shift Registers, PW0016A, LARGE T&R; Manufacturer: Texas Instruments; Bits: 8; No. of Outputs: 2; Voltage(Nom)(V): 2.5, 3.3, 5; 3-State Output: No; Input Type: CMOS; Output Drive (IOL/IOH)(Max)(mA): 50/-50; Technology Family: LV-A; ICC @ Nom Voltage(Max)(mA): 0.02; F @ Nom Voltage(Max)(Mhz): 70; VCC(Max)(V): 5.5; Rating: Catalog; tpd @ Nom Voltage(Max)(ns): 28, 16.9, 13.5; VCC(Min)(V): 2; DatasheetVersion: SCLS402N; Generic Part Number: SN74LV165A; Operating Temperature Range(C): -40 to 125; Output Type: CMOS; PackageVersion: http://www.ti.com/lit/ml/mpds361/mpds361.pdf; Code_JEDEC: MO-153; PackageReference: PW0016A

## Sheet AWG_mechanics.SchDoc: RFSOC_SAWG
size 420 x 297 mm; CheckedBy: -; Author: G.Kasprowicz; CompanyName: WUT ISE; DrawnBy: G.Kasprowicz; Organization: WUT ISE; Address1: PW ISE; Address2: Nowowiejska 15/19 00-665 Warsaw; Address3: gkasprow@gmail.com; DocumentNumber: 7; Revision: 1; SheetNumber: 7; SheetTotal: 20; ModifiedBy: -; CheckedDate: -; Title2: Mechanics; DivGrp: WUT ISE; Designer: G.Kasprowicz; ModifiedDate: -; ProjectName: Sensor Box
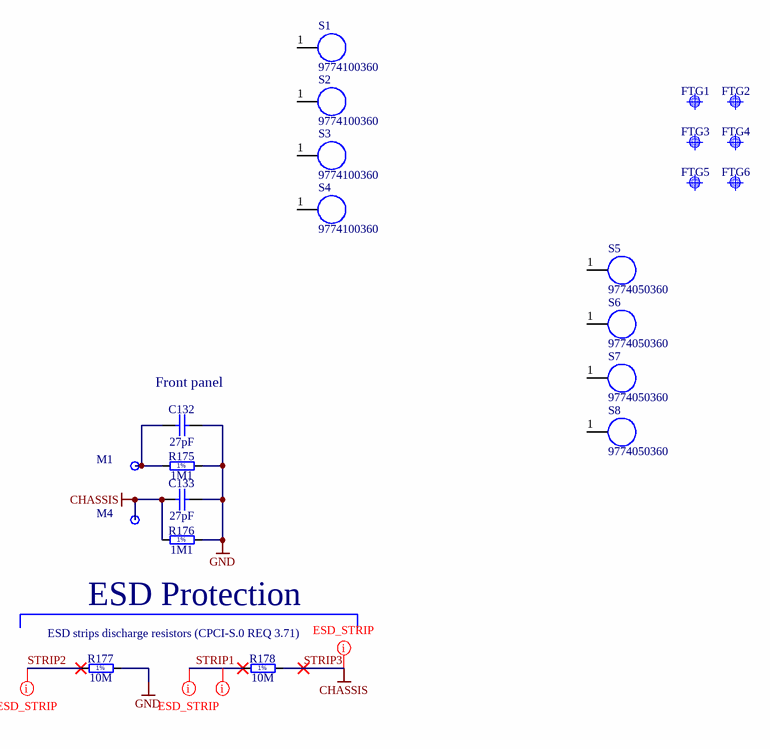
[diagram p18: AWG_mechanics.SchDoc]

### Parts
C132  27pF  [CAPC1005X55N]
C133  27pF  [CAPC1005X55N]
FTG1  Use only in PCB  [FIDUCIAL_TOP_C100-200]  (value not drawn)  (no BOM)
FTG2  Use only in PCB  [FIDUCIAL_TOP_S100-200]  (value not drawn)  (no BOM)
FTG3  Use only in PCB  [FIDUCIAL_TOP_C100-200]  (value not drawn)  (no BOM)
FTG4  Use only in PCB  [FIDUCIAL_TOP_S100-200]  (value not drawn)  (no BOM)
FTG5  Use only in PCB  [FIDUCIAL_TOP_C100-200]  (value not drawn)  (no BOM)
FTG6  Use only in PCB  [FIDUCIAL_TOP_S100-200]  (value not drawn)  (no BOM)
M1  Plated Hole  [MTG300_600]  (value not drawn)  (no BOM)
M4  Plated Hole  [MTG300_600]  (value not drawn)  (no BOM)
R175  1M1  [RESC2012X60N]
R176  1M1  [RESC2012X60N]
R177  10M  [RESC2113X55N]
R178  10M  [RESC2113X55N]
S1  9774100360  [9774100360]
S2  9774100360  [9774100360]
S3  9774100360  [9774100360]
S4  9774100360  [9774100360]
S5  9774050360  [9774050360]
S6  9774050360  [9774050360]
S7  9774050360  [9774050360]
S8  9774050360  [9774050360]

### Nets
GND: C132.2 C133.2 R175.2 R176.2 R177.2
STRIP3: C133.1 M4.1 R176.1 R178.2  [also labelled CHASSIS]
STRIP1: R178.1
STRIP2: R177.1
NetC132_1: C132.1 M1.1 R175.1

Not connected (* = marked no-connect by the designer): S1 1; S2 1; S3 1; S4 1; S5 1; S6 1; S7 1; S8 1

### Layout directives
net class ESD_STRIP: STRIP1, STRIP2, STRIP3
net class PWR: STRIP1

### Notes on the sheet
- (near C132) Front panel
- ESD Protection
- ESD strips discharge resistors (CPCI-S.0 REQ 3.71)
- Project/Equipment
- Document
- Designer
- Drawn by
- Check.by
- Copyright WUT ISE 2020.
  This documentation describes Open Hardware and is licensed under the CERN OHL v.1.2. You may redistribute and modify this documentation under the terms of the CERN OHL v.1.2. (http://ohwr.org/CERNOHL). This documentation is distributed WITHOUT ANY EXPRESS OR IMPLIED WARRANTY, INCLUDING OF MERCHANTABILITY, SATISFACTORY QUALITY AND FITNESS FOR A PARTICULAR PURPOSE. Please see the CERN OHL v.1.2 for applicable conditions.
- Contact
- File
- Last Mod.
- Print Date
- Sheet
- Size
- A3
- of
- Rev
- (in symbol R0805_1M1_1%_0.125W_100PPM) 1%
- (in symbol R0805_10M_1%_0.125W_100PPM_VISHAY_CRCW e3) 1%

### Library data of the parts
C132 C133 = CC0402_27PF_50V_5%_C0G: Non-polarised capacitor; Part Description: SMD Multilayer Chip Ceramic Capacitor; Manufacturer: GENERIC; Manufacturer1 Part Number: C0402C270J5GACTU; Voltage: 50V; TC: C0G/NP0; Tolerance: ±5%; Part Number: CC0402_27PF_50V_5%_C0G; Component Kind: Standard; Component Type: Standard; Pin Count: 2; Value: 27pF; Status: Preferred; Manufacturer Part Number: CC0402_27PF_50V_5%_C0G; Case: 0402; Mounted: Yes; Socket: No; SMD: Yes; Manufacturer1 Example: KEMET; Manufacturer1 ComponentHeight: 0.55mm; HelpURL: \\cern.ch\dfs\Applications\Altium\Datasheets\CC0402_C0G_KEMET_(Commercial Grade).pdf; Author: CERN DEM JLC; CreateDate: 25/10/2012; LatestRevisionDate: 22/04/2015; Sense: No
FTG1 FTG3 FTG5 = FIDUCIAL_TARGET_C100-200: Fiducial Target; Part Description: Round Fiducial Target, Top Layer, 1.0mm, Top Solder 2.0mm, Keepout =2.0mm; Mounted: No; Part Number: FIDUCIAL_TARGET_C100-200; Component Type: Standard (No BOM); Pin Count: 1; Family: Fiducial; Socket: No; SMD: Yes; Sense: No; Status: None; ComponentHeight: 0mm; HelpURL: Undefined; Author: CERN DEM JLC; CreateDate: 09.02.2010; LatestRevisionDate: 04.04.2012; PackageDescription: Round Fiducial Target, Top Layer, 1.0mm, Top Solder 2.0mm, Keepout =2.0mm
FTG2 FTG4 FTG6 = FIDUCIAL_TARGET_S100-200: Fiducial Target; Part Description: Square Fiducial Target, Top Layer, 1.0mm, Top Solder 2.0mm, Keepout =2.0mm; Mounted: No; Part Number: FIDUCIAL_TARGET_S100-200; Component Type: Standard (No BOM); Pin Count: 1; Family: Fiducial; Socket: No; SMD: Yes; Sense: No; Status: None; ComponentHeight: 0mm; HelpURL: Undefined; Author: CERN DEM JLC; CreateDate: 09.02.2010; LatestRevisionDate: 04.04.2012; PackageDescription: Square Fiducial Target, Top Layer, 1.0mm, Top Solder 2.0mm, Keepout =2.0mm
M1 M4 = PLATED_HOLE3.0_PAD6.0: Single Terminal Socket; Part Description: Plated Through Hole: Hole Dia.=3.0mm Pad Dia.=6.0mm; Mounted: No; Table: Pads; Part Number: PLATED_HOLE3.0_PAD6.0; Component Type: Standard (No BOM); Designator: Single Terminal Socket; Library Reference: Single Terminal Socket; Pin Count: 1; Family: Plated Hole; Socket: No; SMD: No; Status: None; ComponentHeight: 0mm; Author: CERN DEM JLC; CreateDate: 26.05.2008; LatestRevisionDate: 26.05.2008; PackageDescription: Plated Through Hole: Hole Dia.=3.0mm Pad Dia.=6.0mm
R175 R176 = R0805_1M1_1%_0.125W_100PPM: Resistor - 1%; Part Description: General Purpose Thick Film Chip Resistor; Manufacturer: GENERIC; Manufacturer1 Part Number: NRC10F1104TRF; Power: 0.125W; TC: ±100ppm/°C; PressFit: No; Part Number: R0805_1M1_1%_0.125W_100PPM; Component Kind: Standard; Component Type: Standard; Pin Count: 2; Value: 1M1; Status: Preferred; Tolerance: ±1%; Manufacturer Part Number: R0805_1M1_1%_0.125W_100PPM; Case: 0805; Mounted: Yes; Sense: No; Socket: No; SMD: Yes; Manufacturer1 Example: NIC COMPONENT; Manufacturer1 ComponentHeight: 0.6mm; HelpURL: \\cern.ch\dfs\Applications\Altium\Datasheets\R0805_NIC_NRC.pdf; Author: CERN DEM JLC; CreateDate: 03/12/2007; LatestRevisionDate: 13/03/2008
R177 R178 = R0805_10M_1%_0.125W_100PPM_VISHAY_CRCW e3: Resistor - 1%; Part Description: 150V, Standard Thick Film Chip Resistor; Manufacturer: VISHAY DALE; Manufacturer Part Number: CRCW080510M0FKEA; Power: 0.125W; TC: ±100ppm/°C; PressFit: No; Part Number: R0805_10M_1%_0.125W_100PPM_VISHAY_CRCW e3; Component Kind: Standard; Component Type: Standard; Pin Count: 2; Value: 10M; Status: None; Tolerance: ±1%; Case: 0805; Mounted: Yes; Sense: No; Socket: No; SMD: Yes; ComponentHeight: 0.5mm; HelpURL: \\cern.ch\dfs\Applications\Altium\Datasheets\R0805_VISHAY_CRCW e3.pdf; Author: CERN DEM BC; CreateDate: 2019-11-12; LatestRevisionDate: 2019-11-12
S1-S4 = WA-SMSI,  9774100360: WA-SMSI SMD Steel Spacer with internal Thread; Manufacturer: Wurth Elektronik; partNo: 9774100360; ComponentLink1Description: Manufacturer; ComponentLink1URL: http://www.we-online.de; Created by: Baojun Chen; Created Date: 20.Oct.2015; ComponentLink2Description: Datasheet; ComponentLink2URL: http://katalog.we-online.de/em/datasheet/9774100360.pdf
S5-S8 = WA-SMSI,  9774050360: WA-SMSI SMD Steel Spacer with internal Thread; Manufacturer: Wurth Elektronik; partNo: 9774050360; ComponentLink1Description: Manufacturer; ComponentLink1URL: http://www.we-online.de; Created by: Baojun Chen; Created Date: 20.Oct.2015; ComponentLink2Description: Datasheet; ComponentLink2URL: http://katalog.we-online.de/em/datasheet/9774050360.pdf